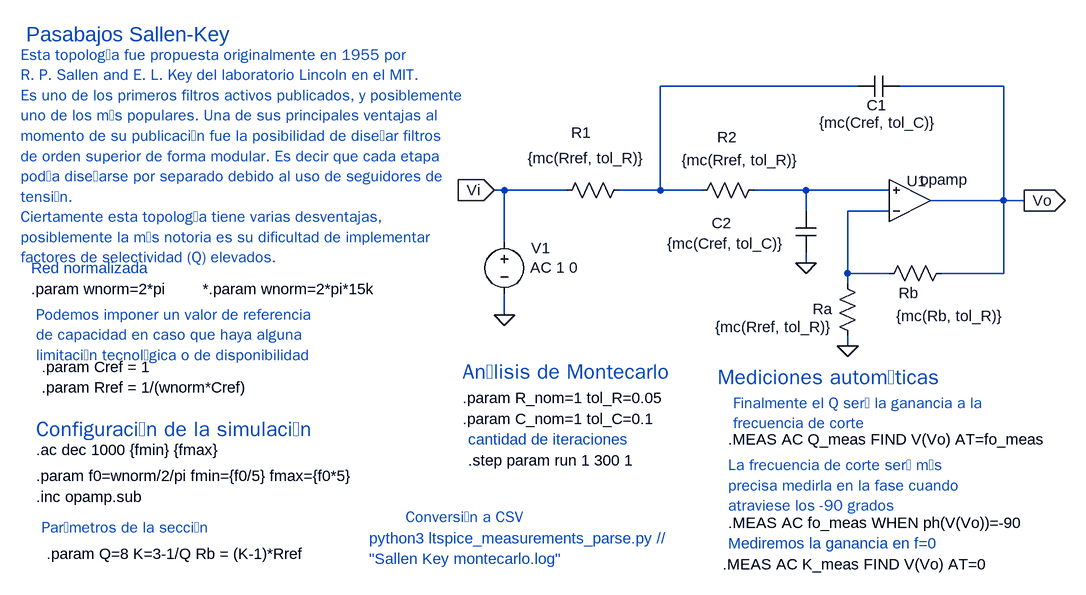
[diagram p0: schematic Sallen Key montecarlo.asc]
Sallen Key montecarlo.asc, the LTspice schematic file:
Version 4
SHEET 1 1364 984
WIRE 320 -16 16 -16
WIRE 544 -16 384 -16
WIRE -224 144 -240 144
WIRE -128 144 -224 144
WIRE 16 144 16 -16
WIRE 16 144 -48 144
WIRE 80 144 16 144
WIRE 240 144 160 144
WIRE 368 144 240 144
WIRE 544 160 544 -16
WIRE 544 160 432 160
WIRE 576 160 544 160
WIRE 240 176 240 144
WIRE 368 176 304 176
WIRE -224 224 -224 144
WIRE 240 256 240 240
WIRE 304 272 304 176
WIRE 368 272 304 272
WIRE 544 272 544 160
WIRE 544 272 448 272
WIRE 304 288 304 272
WIRE -224 336 -224 304
WIRE 304 384 304 368
FLAG 304 384 0
FLAG 240 256 0
FLAG -240 144 Vi
IOPIN -240 144 In
FLAG 576 160 Vo
IOPIN 576 160 Out
FLAG -224 336 0
SYMBOL OpAmps\\opamp 400 224 M180
WINDOW 0 -5 94 Left 2
SYMATTR InstName U1
SYMBOL res -32 128 R90
WINDOW 0 -57 74 VBottom 2
WINDOW 3 -18 66 VBottom 2
SYMATTR InstName R1
SYMATTR Value {mc(Rref, tol_R)}
SYMBOL res 176 128 R90
WINDOW 0 -50 57 VBottom 2
WINDOW 3 -15 37 VBottom 2
SYMATTR InstName R2
SYMATTR Value {mc(Rref, tol_R)}
SYMBOL res 320 384 R180
WINDOW 0 39 57 Left 2
WINDOW 3 39 29 Left 2
SYMATTR InstName Ra
SYMATTR Value {mc(Rref, tol_R)}
SYMBOL res 352 288 R270
WINDOW 0 -30 46 VTop 2
WINDOW 3 -65 110 VTop 2
SYMATTR InstName Rb
SYMATTR Value {mc(Rb, tol_R)}
SYMBOL cap 384 -32 R90
WINDOW 0 61 35 VBottom 2
WINDOW 3 88 33 VBottom 2
SYMATTR InstName C1
SYMATTR Value {mc(Cref, tol_C)}
SYMBOL cap 256 240 R180
WINDOW 0 130 45 Left 2
WINDOW 3 49 14 Left 2
SYMATTR InstName C2
SYMATTR Value {mc(Cref, tol_C)}
SYMBOL voltage -224 208 R0
WINDOW 123 40 55 Left 2
WINDOW 39 0 0 Left 0
WINDOW 0 41 25 Left 2
SYMATTR Value2 AC 1 0
SYMATTR InstName V1
SYMATTR Value ""
TEXT -944 544 Left 2 !.ac dec 1000 {fmin} {fmax}
TEXT -952 264 Left 2 ;Red normalizada
TEXT -952 296 Left 2 !.param wnorm=2*pi
TEXT -944 512 Left 3 ;Configuraci�n de la simulaci�n
TEXT -928 704 Left 2 !.param Q=8 K=3-1/Q Rb = (K-1)*Rref
TEXT -936 664 Left 2 ;Par�metros de la secci�n
TEXT -944 584 Left 2 !.param f0=wnorm/2/pi fmin={f0/5} fmax={f0*5}
TEXT -944 616 Left 2 !.inc opamp.sub
TEXT -280 560 Left 2 !.step param run 1 300 1
TEXT -288 424 Left 3 ;An�lisis de Montecarlo
TEXT -288 496 Left 2 !.param C_nom=1 tol_C=0.1
TEXT -288 464 Left 2 !.param R_nom=1 tol_R=0.05
TEXT 120 528 Left 2 !.MEAS AC Q_meas FIND V(Vo) AT=fo_meas
TEXT 120 656 Left 2 !.MEAS AC fo_meas WHEN ph(V(Vo))=-90
TEXT 112 720 Left 2 !.MEAS AC K_meas FIND V(Vo) AT=0
TEXT 104 432 Left 3 ;Mediciones autom�ticas
TEXT 120 688 Left 2 ;Mediremos la ganancia en f=0
TEXT 120 568 Left 2 ;La frecuencia de corte ser� m�s \nprecisa medirla en la fase cuando \natraviese los -90 grados
TEXT 128 472 Left 2 ;Finalmente el Q ser� la ganancia a la \nfrecuencia de corte
TEXT -280 528 Left 2 ;cantidad de iteraciones
TEXT -936 416 Left 2 !.param Cref = 1
TEXT -936 448 Left 2 !.param Rref = 1/(wnorm*Cref)
TEXT -688 296 Left 2 !*.param wnorm=2*pi*15k
TEXT -944 336 Left 2 ;Podemos imponer un valor de referencia\nde capacidad en caso que haya alguna\nlimitaci�n tecnol�gica o de disponibilidad
TEXT -960 -96 Left 3 ;Pasabajos Sallen-Key
TEXT -968 -64 Left 2 ;Esta topolog�a fue propuesta originalmente en 1955 por \nR. P. Sallen and E. L. Key del laboratorio Lincoln en el MIT.\nEs uno de los primeros filtros activos publicados, y posiblemente \nuno de los m�s populares. Una de sus principales ventajas al \nmomento de su publicaci�n fue la posibilidad de dise�ar filtros \nde orden superior de forma modular. Es decir que cada etapa \npod�a dise�arse por separado debido al uso de seguidores de \ntensi�n. \nCiertamente esta topolog�a tiene varias desventajas, \nposiblemente la m�s notoria es su dificultad de implementar \nfactores de selectividad (Q) elevados.
TEXT -432 680 Left 2 ;python3 ltspice_measurements_parse.py //\n"Sallen Key montecarlo.log"
TEXT -376 648 Left 2 ;Conversi�n a CSV

The netlist it stands for:
* Sallen Key montecarlo.asc
XU1 N003 N002 Vo opamp Aol=100K GBW=10Meg  ; pins invin noninvin out
R1 N001 Vi {mc(Rref, tol_R)}
R2 N002 N001 {mc(Rref, tol_R)}
Ra 0 N003 {mc(Rref, tol_R)}
Rb N003 Vo {mc(Rb, tol_R)}
C1 Vo N001 {mc(Cref, tol_C)}
C2 0 N002 {mc(Cref, tol_C)}
V1 Vi 0 AC 1 0
.ac dec 1000 {fmin} {fmax}
* Red normalizada
.param wnorm=2*pi
* Configuraci�n de la simulaci�n
.param Q=8 K=3-1/Q Rb = (K-1)*Rref
* Par�metros de la secci�n
.param f0=wnorm/2/pi fmin={f0/5} fmax={f0*5}
.inc opamp.sub
.step param run 1 300 1
* An�lisis de Montecarlo
.param C_nom=1 tol_C=0.1
.param R_nom=1 tol_R=0.05
.MEAS AC Q_meas FIND V(Vo) AT=fo_meas
.MEAS AC fo_meas WHEN ph(V(Vo))=-90
.MEAS AC K_meas FIND V(Vo) AT=0
* Mediciones autom�ticas
* Mediremos la ganancia en f=0
* La frecuencia de corte ser� m�s
* precisa medirla en la fase cuando
* atraviese los -90 grados
* Finalmente el Q ser� la ganancia a la
* frecuencia de corte
* cantidad de iteraciones
.param Cref = 1
.param Rref = 1/(wnorm*Cref)
*.param wnorm=2*pi*15k
* Podemos imponer un valor de referencia
* de capacidad en caso que haya alguna
* limitaci�n tecnol�gica o de disponibilidad
* Pasabajos Sallen-Key
* Esta topolog�a fue propuesta originalmente en 1955 por
* R. P. Sallen and E. L. Key del laboratorio Lincoln en el MIT.
* Es uno de los primeros filtros activos publicados, y posiblemente
* uno de los m�s populares. Una de sus principales ventajas al
* momento de su publicaci�n fue la posibilidad de dise�ar filtros
* de orden superior de forma modular. Es decir que cada etapa
* pod�a dise�arse por separado debido al uso de seguidores de
* tensi�n.
* Ciertamente esta topolog�a tiene varias desventajas,
* posiblemente la m�s notoria es su dificultad de implementar
* factores de selectividad (Q) elevados.
* python3 ltspice_measurements_parse.py //
* "Sallen Key montecarlo.log"
* Conversi�n a CSV
.backanno
.end